# Altium schematic sheet DAC8552.SchDoc
size A4; DocumentNumber: 1; SheetNumber: 1; SheetTotal: 1
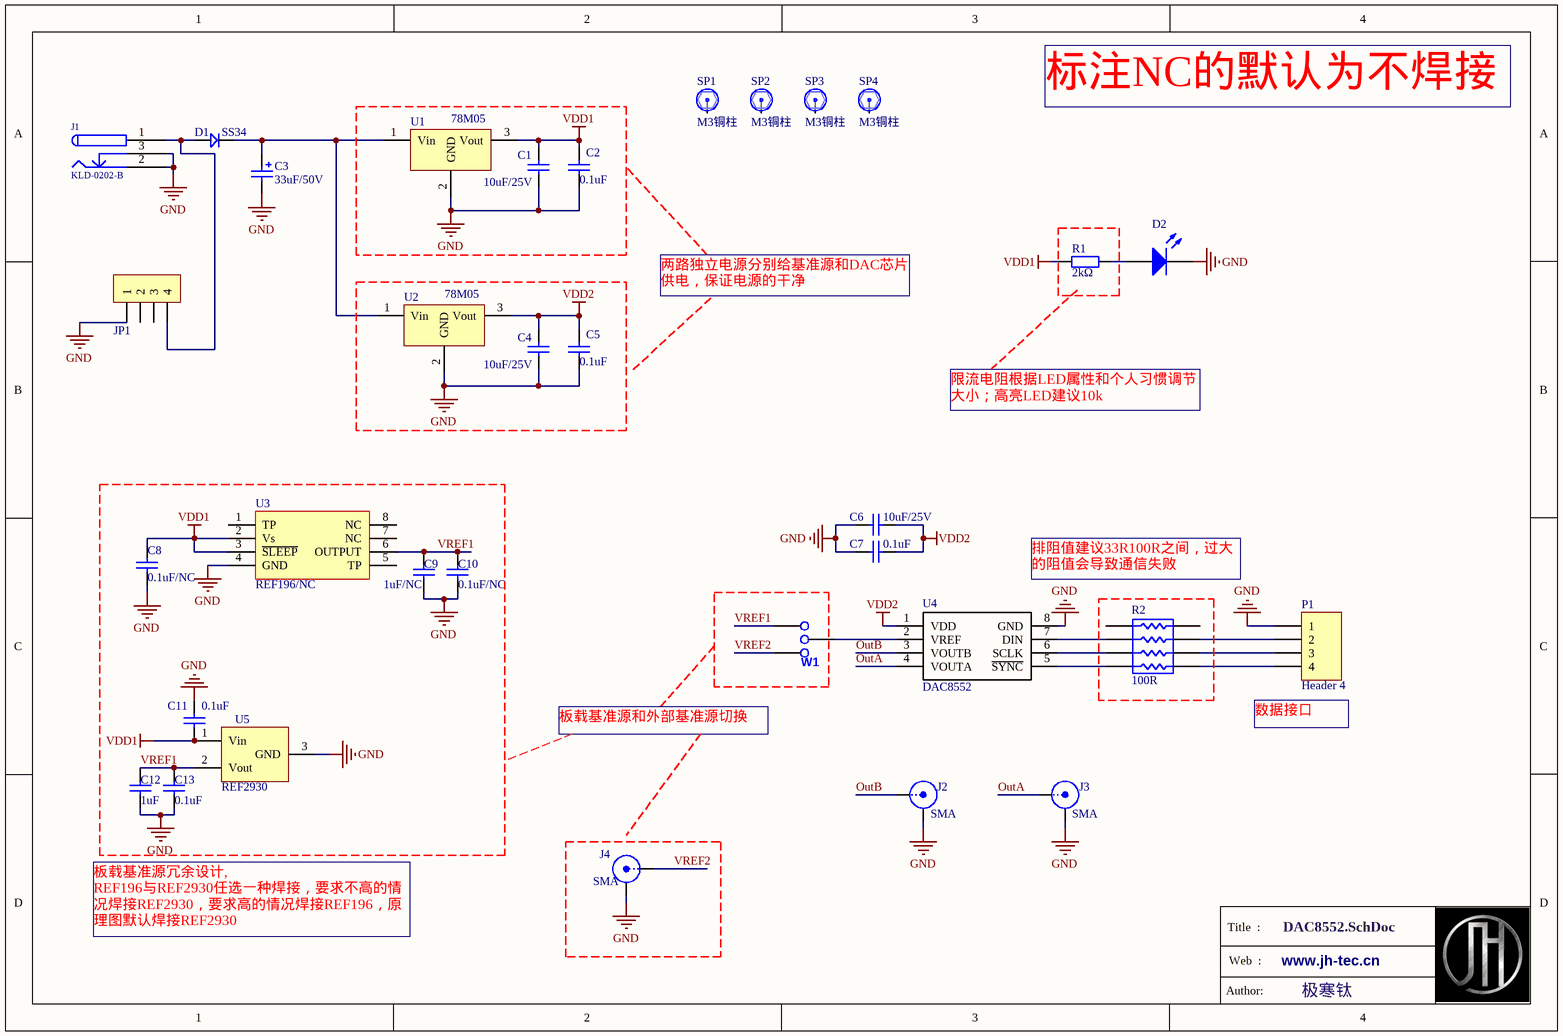
[diagram p0: DAC8552.SchDoc]

## Parts
C1  Sch Name: 10uF/25V  [CAP MLCC 0805]  (hidden comment: 10uF/25V/0603)
C2  0.1uF  [C0603]
C3  33uF/50V  [C6.3*7.7]
C4  Sch Name: 10uF/25V  [CAP MLCC 0805]  (hidden comment: 10uF/25V/0603)
C5  0.1uF  [C0603]
C6  Sch Name: 10uF/25V  [CAP MLCC 0805]  (hidden comment: 10uF/25V/0603)
C7  0.1uF  [C0603]
C8  0.1uF/NC  [C0603]
C9  1uF/NC  [C0603]
C10  0.1uF/NC  [C0603]
C11  value 0.1uF  [C0603]
C12  1uF  [C0603]
C13  0.1uF  [C0603]
D1  SS34  [DO-214AC]
D2  LED3  [LED_GREEN_0603]  (value not drawn)
J1  KLD-0202-B  [DC005]
J2  SMA  [SMA_3D]
J3  SMA  [SMA_3D]
J4  SMA  [SMA_RJ45]
JP1  HDR-1X4  [XH2.54-WI-4P]  (value not drawn)
P1  Header 4  [XH2.54x4]
R1  2kΩ  [R0603]
R2  100R  [RA4]
SP1  M3铜柱  [M3x4+6_L]
SP2  M3铜柱  [M3x4+6_L]
SP3  M3铜柱  [M3x4+6_L]
SP4  M3铜柱  [M3x4+6_L]
U1  78M05  [SOT223_M]
U2  78M05  [SOT223_M]
U3  REF196/NC  [SOP-8]
U4  DAC8552  [SOP65P490X110-8N]
U5  REF2930  [SOT23-3]
W1  key  [HDR1X3]  (value not drawn)

## Nets
GND: C1.2 C2.2 C3.2 C4.2 C5.2 C6.1 C7.2 C8.2 C9.2 C10.2 C11.2 C12.2 C13.2 D2.2(K) J1.2 J1.3 J2.2(Y) J3.2(Y) J4.2(Y) JP1.1 P1.1 U1.2(GND) U2.2(GND) U3.4(GND) U4.8(GND) U5.3(GND)
VDD1: C1.1 C2.1 C8.1 C11.1 R1.2 U1.3(Vout) U3.2(Vs) U3.3(~{SLEEP}) U5.1(Vin)
VDD2: C4.1 C5.1 C6.2 C7.1 U2.3(Vout) U4.1(VDD)
OutA: J3.1(X) U4.4(VOUTA)
OutB: J2.1(X) U4.3(VOUTB)
VREF1: C9.1 C10.1 C12.1 C13.1 U3.6(OUTPUT) U5.2(Vout) W1.3
VREF2: J4.1(X) W1.1
NetC3_1: C3.1 D1.2 U1.1(Vin) U2.1(Vin)
NetD1_1: D1.1 J1.1 JP1.4
NetD2_1: D2.1(A) R1.1
NetP1_2: P1.2 R2.4
NetP1_3: P1.3 R2.6
NetP1_4: P1.4 R2.8
NetR2_3: R2.3 U4.7(DIN)
NetR2_5: R2.5 U4.6(SCLK)
NetR2_7: R2.7 U4.5(~{SYNC})
NetU4_2: U4.2(VREF) W1.2

Not connected (* = marked no-connect by the designer): JP1 2 3; R2 1 2; SP1 1; SP2 1; SP3 1; SP4 1; U3 1(TP) 5(TP) 7(NC) 8(NC)

## Notes on the sheet
- 标注NC的默认为不焊接
- 两路独立电源分别给基准源和DAC芯片供电，保证电源的干净
- 限流电阻根据LED属性和个人习惯调节大小；高亮LED建议10k
- 排阻值建议33R100R之间，过大的阻值会导致通信失败
- 板载基准源和外部基准源切换
- (near P1) 数据接口
- 板载基准源冗余设计,
  REF196与REF2930任选一种焊接，要求不高的情况焊接REF2930，要求高的情况焊接REF196，原理图默认焊接REF2930
- Title  :
- Web  :
- www.jh-tec.cn
- Author:
- 极寒钛

## Library data of the parts
C1 C4 C6 = Cap Semi: Capacitor (Semiconductor SIM Model); Manufacture: 10uF/25V/0603
C2 C5 C7-C10 C12 C13 = Cap Semi: Capacitor (Semiconductor SIM Model); Value: 103; Published: 8-Jun-2000; LatestRevisionDate: 29-May-2009; LatestRevisionNote: IPC-7351 Footprint Added.; PackageReference: C1206; Publisher: Altium Limited; PackageDescription: Chip Capacitor
C3 = Cap Pol3_1: Polarized Capacitor (Surface Mount); Value: 100uF; Published: 8-Jun-2000; LatestRevisionDate: 29-May-2009; LatestRevisionNote: IPC-7351 Footprint Added.; PackageReference: C0805; Publisher: Altium Limited; PackageDescription: Chip Capacitor
C11 = Cap: Capacitor; Published: 8-Jun-2000; LatestRevisionDate: 17-Jul-2002; LatestRevisionNote: Re-released for DXP Platform.; PackageReference: RAD-0.3; Publisher: Altium Limited; PackageDescription: Radial Cap, Thru-Hole; 2 Leads; 0.3 in Pin Spacing
D1 = D: 1N4148
D2 = LED3: Typical BLUE SiC LED; Published: 8-Jun-2000; LatestRevisionDate: 17-Dec-2003; LatestRevisionNote: PCB Footprint replaced.; DatasheetVersion: 16-Apr-2002; PackageVersion: 16-Apr-2002; PackageReference: 3.5X2.8X1.9; Publisher: Altium Limited; PackageDescription: SM LED; 2 C-Bend Leads; Body 3.5 x 2.8 x 1.9 mm, inc leads (LxWxH typ)
J1 = KLD-0202-B: Low Voltage Power Supply Connector; Manufacturer: Kycon; AEMS Code: 3510211
JP1 = Header 4: 4P接插件; BOM名称: 4P接插件
P1 = Header 4: Header, 4-Pin; LatestRevisionDate: *; LatestRevisionNote: *; Publisher: *
R1 = Res2: Resistor; Value: 1K; Published: 8-Jun-2000; LatestRevisionDate: 17-Jul-2002; LatestRevisionNote: Re-released for DXP Platform.; Publisher: Altium Limited
R2 = RESPACK1
SP1-SP4 = 铜柱加头小焊盘: 铜柱; BOM名称: 铜柱
U1 U2 = 78L05
U3 = REF19x
U4 = DAC8552IDGKT: Integrated Circuit; Manufacturer_Name: Texas Instruments; blog: www.jh-tec.cn; Manufacturer_Part_Number: DAC8552IDGKT
U5 = REF29XX
W1 = W: KEY 1 to 2